# EAGLE design DUAL CKT (EAGLE 9.6.2)
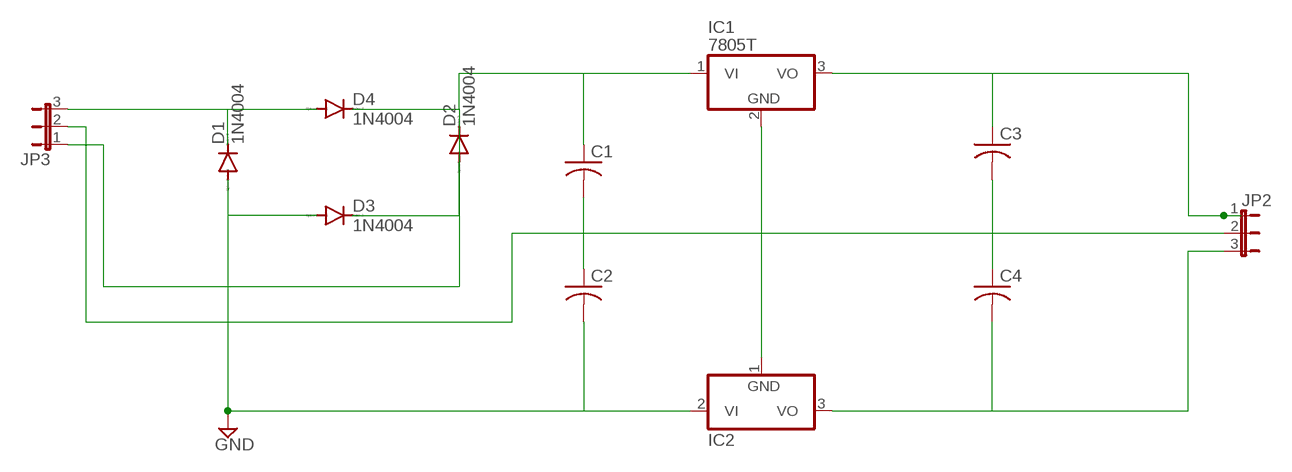
[diagram p0: schematic, sheet 1]

## Parts
C1  C-US025-024X044  [C025-024X044]
C2  C-US025-024X044  [C025-024X044]
C3  C-US025-024X044  [C025-024X044]
C4  C-US025-024X044  [C025-024X044]
D1  1N4004  [DO41-10]
D2  1N4004  [DO41-10]
D3  1N4004  [DO41-10]
D4  1N4004  [DO41-10]
IC1  7805T  [TO220H]
IC2  7905T  [TO220H]
JP2  JP2W  [JP2W]
JP3  JP2W  [JP2W]

## Nets
GND: C2.2 D1.A D3.A IC2.2(VI)
N$1: D1.C D4.A JP3.3
N$2: C1.1 D2.C D4.C IC1.1(VI) JP3.1
N$5: JP2.2 JP3.2
N$6: C1.2 C2.1
N$7: C3.1 IC1.3(VO) JP2.1
N$8: C4.2 IC2.3(VO) JP2.3
N$9: IC1.2(GND) IC2.1(GND)
N$10: C3.2 C4.1
N$11: D2.A D3.C

## Library data of the parts
C1-C4 = rcl:C-US: CAPACITOR, American symbol; SPICEPREFIX: C
D1-D4 = diode:1N4004: DIODE general purpose rectifier, 1 A
IC1 = linear:78*: Positive VOLTAGE REGULATOR Source: http://cache.national.com/ds/LM/LM78L05.pdf http://www.fairchildsemi.com/ds/LM/LM7805.pdf
IC2 = linear:79*: Negative VOLTAGE REGULATOR
JP2 JP3 = jumper:JP2W: JUMPER

## Board
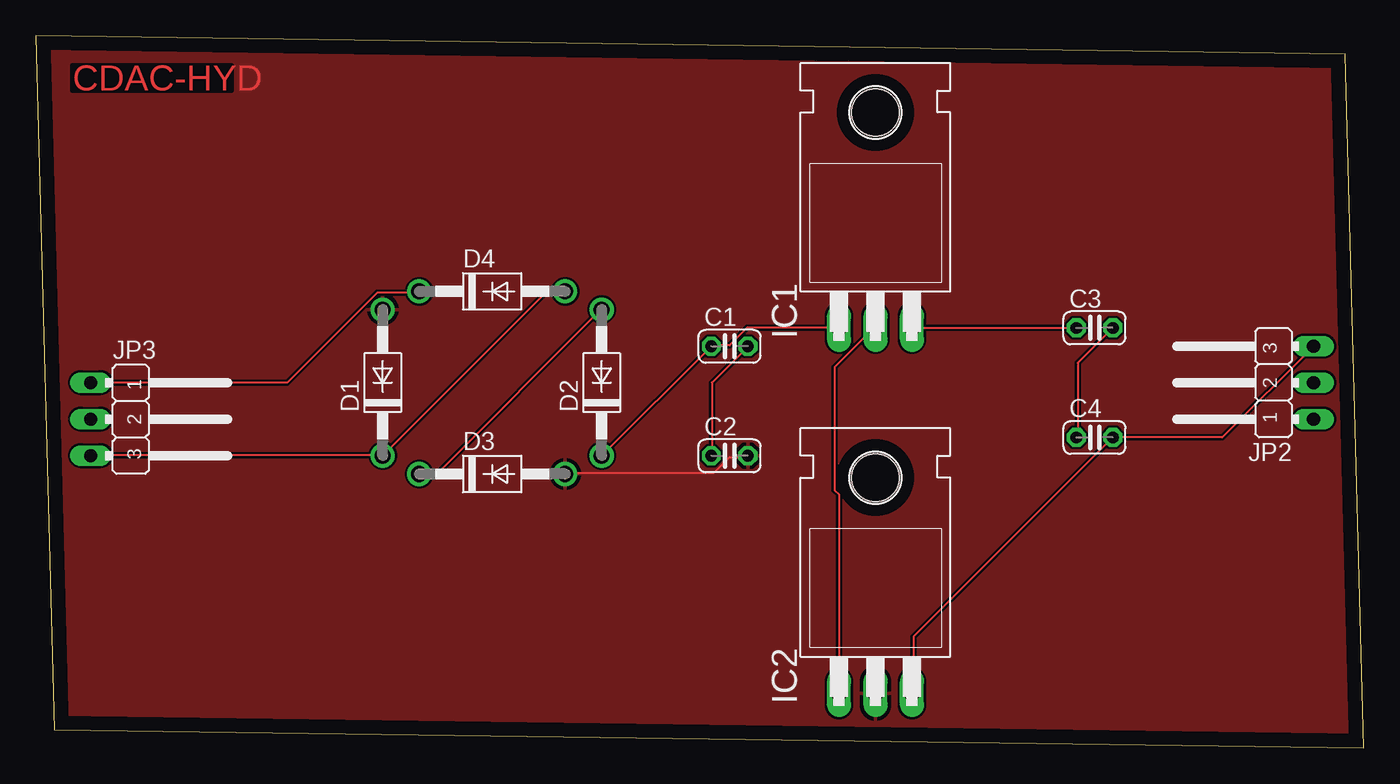
[diagram p1: board, top side]
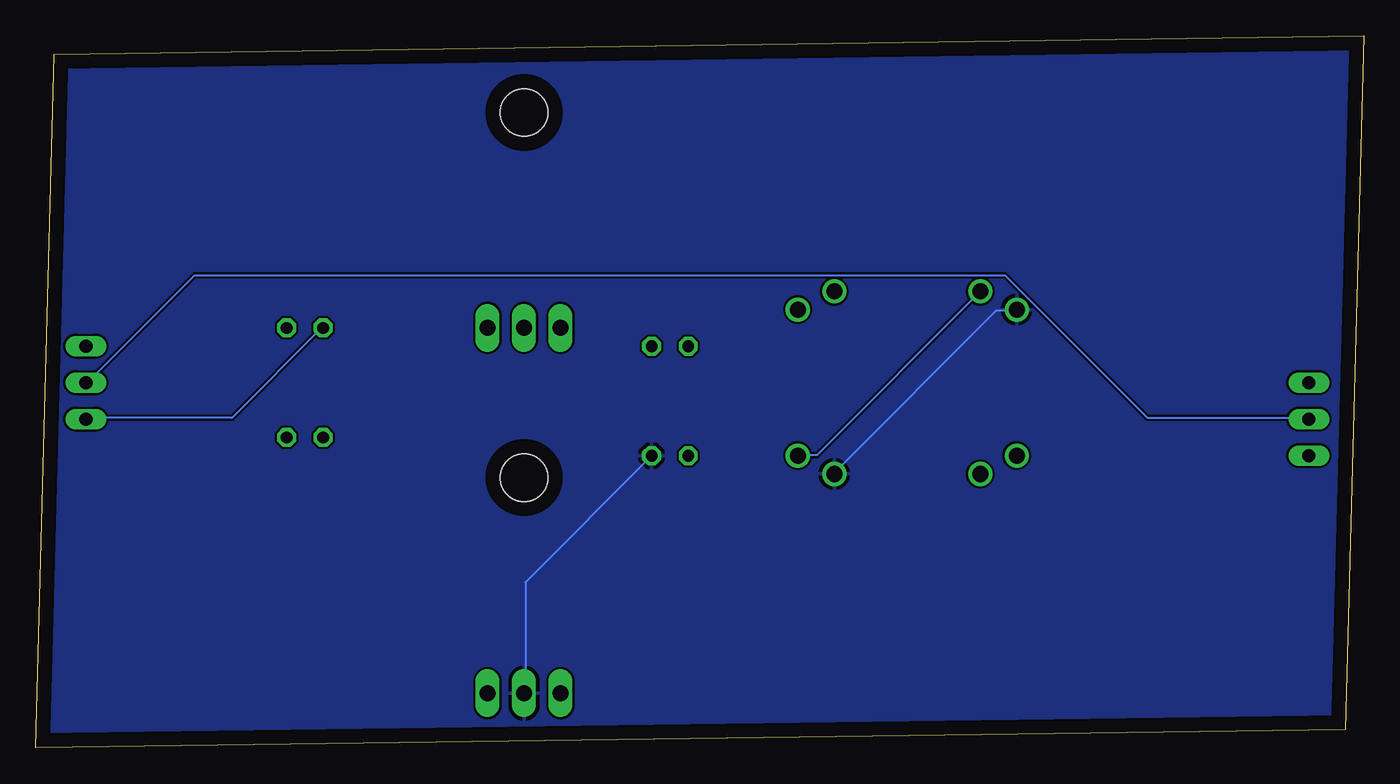
[diagram p2: board, bottom side, seen from below]

Size 92.38 x 49.52 mm. Coordinates in mm from the lower left corner, seen from the top.
Outline: 1.27,1.27 92.38,0 91.11,48.25 0,49.52 1.27,1.27
Copper layers (1*16): Top 0.035mm / dielectric 1.5mm / Bottom 0.035mm
Design rules "default": minimum track width 6mil, minimum drill 0.35mm, track to track 6mil, track to pad 6mil, pad to pad 6mil, via to via 6mil, smd to smd 6mil, copper to edge 40mil, drill to drill 6mil, minimum pad ring 10mil, minimum via ring 8mil, stop-mask expansion 4mil, vias tented up to drill 0mil, thermal gap 10mil

### Footprints (pad centres in the part's own frame; a part is rotated, then mirrored left to right if it is on the bottom)
C025-024X044 = drill 0.813 octagon: 1 -1.27,0; 2 1.27,0
DO41-10 = drill 1.118: A 5.08,0; C -5.08,0
TO220H = drill 1.118 long: 1 -2.54,-10.16; 2 0,-10.16; 3 2.54,-10.16 | hole 3.302: 0,4.826
JP2W = drill 0.914 long: 1 -2.54,-1.27; 2 0,-1.27; 3 2.54,-1.27

### Placement (x,y rotation side)
C1  48.26,27.94 0 top
C2  48.26,20.32 0 top
C3  73.66,29.21 0 top
C4  73.66,21.59 0 top
D1  24.13,25.4 90 top
D2  39.37,25.4 90 top
D3  31.75,19.05 0 top
D4  31.75,31.75 0 top
IC1  58.42,39.37 0 top
IC2  58.42,13.97 0 top
JP2  87.63,25.4 90 top
JP3  5.08,22.86 270 top

### Tracks (layer width: path | path; a pad name or v marks a point on that pad's centre or on a via)
GND
  Top 0.152: C2.2 49.48,20.22 48.26,20.22 47.19,19.15 36.83,19.15 D3.A
  Bottom 0.152: D1.A 24.18,30.43 25.55,30.43 36.83,19.15 D3.A | C2.2 58.32,11.53 58.32,3.91 IC2.2
  pour Top: -2.54,50.8 93.98,50.8 93.98,-2.54 -2.54,-2.54
  pour Bottom: -3.81,52.07 95.25,52.07 95.25,-3.81 -3.81,-3.81
N$1
  Top 0.152: JP3.3 3.91,20.37 24.03,20.37 D1.C 35.46,31.65 36.83,31.65 D4.A
N$2
  Top 0.152: IC1.1 49.48,29.21 48.26,27.99 47.04,27.99 C1.1 D2.C | JP3.1 17.48,25.4 23.72,31.65 26.62,31.65 D4.C
  Bottom 0.152: D4.C 38.05,20.37 39.27,20.37 D2.C
N$5
  Bottom 0.152: JP3.2 3.91,22.96 15.04,22.96 24.94,32.87 81.33,32.87 88.8,25.4 JP2.2
N$6
  Top 0.152: C2.1 47.04,20.37 47.04,25.4 49.48,27.84 C1.2
N$7
  Top 0.152: IC1.3 C3.1
  Bottom 0.152: JP2.1 88.8,22.96 78.74,22.96 72.49,29.21 C3.1
N$8
  Top 0.152: JP2.3 82.55,21.59 C4.2 61.06,7.72 61.06,3.91 IC2.3
N$9
  Top 0.152: IC2.1 55.88,17.63 55.58,17.93 55.58,26.47 58.32,29.21 IC1.2
N$10
  Top 0.152: C3.2 72.49,26.77 72.49,21.59 C4.1
N$11
  Top 0.152: D3.C 26.77,19.15 27.99,19.15 39.27,30.43 D2.A

### Text on the board
Top: CDAC-HYD